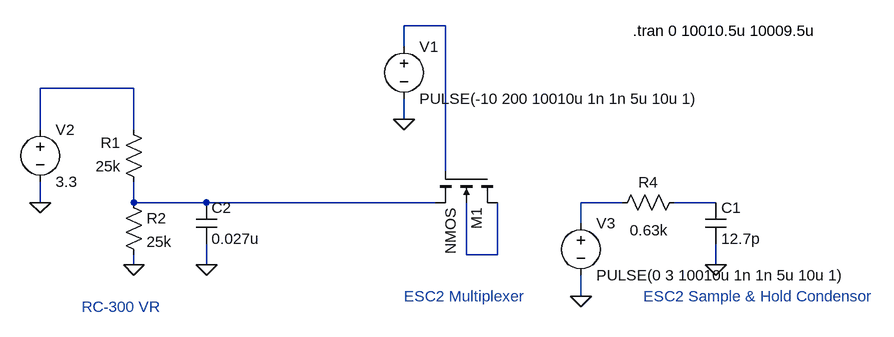
[diagram p0: schematic Draft1.asc]
Draft1.asc, the LTspice schematic file:
Version 4
SHEET 1 880 680
WIRE -32 -96 -96 -96
WIRE -96 -64 -96 -96
WIRE -512 0 -656 0
WIRE -96 48 -96 16
WIRE -656 64 -656 0
WIRE -512 64 -512 0
WIRE -32 128 -32 -96
WIRE -656 176 -656 144
WIRE -512 176 -512 144
WIRE -400 176 -512 176
WIRE -48 176 -400 176
WIRE 240 176 176 176
WIRE 384 176 320 176
WIRE 176 208 176 176
WIRE 0 256 0 176
WIRE 48 256 48 176
WIRE 48 256 0 256
WIRE -512 272 -512 256
WIRE -400 272 -400 240
WIRE 384 272 384 240
WIRE 176 320 176 288
FLAG 384 272 0
FLAG -400 272 0
FLAG -512 272 0
FLAG -96 48 0
FLAG -656 176 0
FLAG 176 320 0
SYMBOL cap 368 176 R0
SYMATTR InstName C1
SYMATTR Value 12.7p
SYMBOL cap -416 176 R0
SYMATTR InstName C2
SYMATTR Value 0.027u
SYMBOL res -496 160 R180
WINDOW 0 36 76 Left 0
WINDOW 3 36 40 Left 0
SYMATTR InstName R1
SYMATTR Value 25k
SYMBOL res -528 160 R0
SYMATTR InstName R2
SYMATTR Value 25k
SYMBOL voltage -96 -80 R0
WINDOW 123 0 0 Left 0
WINDOW 39 0 0 Left 0
SYMATTR InstName V1
SYMATTR Value PULSE(-10 200 10010u 1n 1n 5u 10u 1)
SYMBOL voltage -656 48 R0
WINDOW 123 0 0 Left 0
WINDOW 39 0 0 Left 0
SYMATTR InstName V2
SYMATTR Value 3.3
SYMBOL nmos4 48 128 R90
SYMATTR InstName M1
SYMBOL res 336 160 R90
WINDOW 0 0 56 VBottom 0
WINDOW 3 43 55 VTop 0
SYMATTR InstName R4
SYMATTR Value 0.63k
SYMBOL voltage 176 192 R0
WINDOW 123 0 0 Left 0
WINDOW 39 0 0 Left 0
SYMATTR InstName V3
SYMATTR Value PULSE(0 3 10010u 1n 1n 5u 10u 1)
TEXT 256 -88 Left 0 !.tran 0 10010.5u 10009.5u
TEXT -592 336 Left 0 ;RC-300 VR
TEXT -96 320 Left 0 ;ESC2 Multiplexer
TEXT 272 320 Left 0 ;ESC2 Sample & Hold Condensor

The netlist it stands for:
* Draft1.asc
C1 N005 0 12.7p
C2 N003 0 0.027u
R1 N003 N002 25k
R2 N003 0 25k
V1 N001 0 PULSE(-10 200 10010u 1n 1n 5u 10u 1)
V2 N002 0 3.3
M1 N006 N001 N003 N006 NMOS
R4 N005 N004 0.63k
V3 N004 0 PULSE(0 3 10010u 1n 1n 5u 10u 1)
.model NMOS NMOS
.model PMOS PMOS
.lib standard.mos
.tran 0 10010.5u 10009.5u
* RC-300 VR
* ESC2 Multiplexer
* ESC2 Sample & Hold Condensor
.backanno
.end